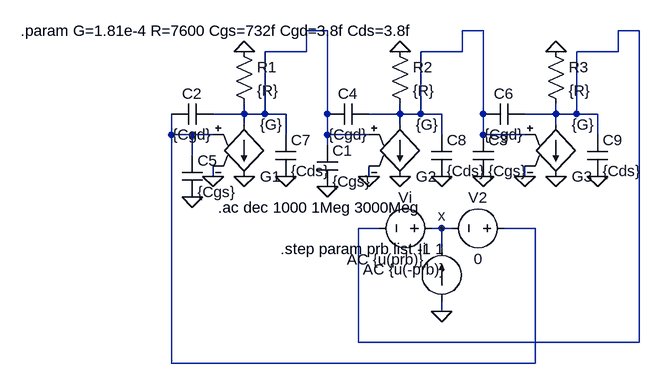
[diagram p0: schematic ringoscssm.asc]
ringoscssm.asc, the LTspice schematic file:
Version 4.1
SHEET 1 880 680
WIRE 256 16 224 16
WIRE 496 16 464 16
WIRE 736 16 704 16
WIRE 224 48 224 16
WIRE 224 48 160 48
WIRE 464 48 464 16
WIRE 464 48 400 48
WIRE 704 48 704 16
WIRE 704 48 640 48
WIRE 128 144 128 128
WIRE 128 144 80 144
WIRE 160 144 160 48
WIRE 160 144 128 144
WIRE 192 144 160 144
WIRE 256 144 256 16
WIRE 368 144 368 128
WIRE 368 144 320 144
WIRE 400 144 400 48
WIRE 400 144 368 144
WIRE 432 144 400 144
WIRE 496 144 496 16
WIRE 512 144 496 144
WIRE 608 144 608 128
WIRE 608 144 560 144
WIRE 640 144 640 48
WIRE 640 144 608 144
WIRE 672 144 640 144
WIRE 128 160 128 144
WIRE 368 160 368 144
WIRE 608 160 608 144
WIRE 16 176 16 144
WIRE 48 176 16 176
WIRE 80 176 48 176
WIRE 192 176 192 144
WIRE 256 176 256 144
WIRE 320 176 256 176
WIRE 432 176 432 144
WIRE 496 176 496 144
WIRE 560 176 496 176
WIRE 672 176 672 144
WIRE 256 192 256 176
WIRE 48 208 48 176
WIRE 80 240 80 224
WIRE 320 240 320 224
WIRE 560 240 560 224
WIRE 336 320 304 320
WIRE 432 320 416 320
WIRE 448 320 432 320
WIRE 576 320 528 320
WIRE 432 352 432 320
WIRE 432 448 432 432
WIRE 304 496 304 320
WIRE 736 496 736 16
WIRE 736 496 304 496
WIRE 16 528 16 176
WIRE 576 528 576 320
WIRE 576 528 16 528
FLAG 80 240 0
FLAG 128 240 0
FLAG 256 256 0
FLAG 368 48 0
FLAG 320 240 0
FLAG 368 240 0
FLAG 496 240 0
FLAG 608 48 0
FLAG 560 240 0
FLAG 608 240 0
FLAG 432 448 0
FLAG 432 320 x
FLAG 48 272 0
FLAG 192 240 0
FLAG 432 240 0
FLAG 672 240 0
FLAG 128 48 0
SYMBOL g2 128 256 M180
SYMATTR InstName G1
SYMATTR Value {G}
SYMBOL res 112 32 R0
SYMATTR InstName R1
SYMATTR Value {R}
SYMBOL cap 240 192 R0
SYMATTR InstName C1
SYMATTR Value {Cgs}
SYMBOL cap 80 128 R90
WINDOW 0 0 32 VBottom 2
WINDOW 3 32 32 VTop 2
SYMATTR InstName C2
SYMATTR Value {Cgd}
SYMBOL g2 368 256 M180
SYMATTR InstName G2
SYMATTR Value {G}
SYMBOL res 352 32 R0
SYMATTR InstName R2
SYMATTR Value {R}
SYMBOL cap 480 176 R0
SYMATTR InstName C3
SYMATTR Value {Cgs}
SYMBOL cap 320 128 R90
WINDOW 0 0 32 VBottom 2
WINDOW 3 32 32 VTop 2
SYMATTR InstName C4
SYMATTR Value {Cgd}
SYMBOL g2 608 256 M180
SYMATTR InstName G3
SYMATTR Value {G}
SYMBOL res 592 32 R0
SYMATTR InstName R3
SYMATTR Value {R}
SYMBOL cap 32 208 R0
SYMATTR InstName C5
SYMATTR Value {Cgs}
SYMBOL cap 560 128 R90
WINDOW 0 0 32 VBottom 2
WINDOW 3 32 32 VTop 2
SYMATTR InstName C6
SYMATTR Value {Cgd}
SYMBOL voltage 432 320 R90
WINDOW 0 -32 56 VBottom 2
WINDOW 3 32 56 VTop 2
WINDOW 123 48 56 VTop 2
WINDOW 39 0 0 Left 0
SYMATTR InstName Vi
SYMATTR Value ""
SYMATTR Value2 AC {u(-prb)}
SYMBOL voltage 544 320 R90
WINDOW 0 -32 56 VBottom 2
WINDOW 3 32 56 VTop 2
WINDOW 123 0 0 Left 0
WINDOW 39 0 0 Left 0
SYMATTR InstName V2
SYMATTR Value 0
SYMBOL current 432 432 R180
WINDOW 0 24 80 Left 2
WINDOW 3 24 0 Left 2
WINDOW 123 24 64 Left 2
WINDOW 39 0 0 Left 0
SYMATTR InstName Ii
SYMATTR Value ""
SYMATTR Value2 AC {u(prb)}
SYMBOL cap 176 176 R0
SYMATTR InstName C7
SYMATTR Value {Cds}
SYMBOL cap 416 176 R0
SYMATTR InstName C8
SYMATTR Value {Cds}
SYMBOL cap 656 176 R0
SYMATTR InstName C9
SYMATTR Value {Cds}
TEXT 88 288 Left 2 !.ac dec 1000 1Meg 3000Meg
TEXT 184 352 Left 2 !.step param prb list -1 1
TEXT -216 16 Left 2 !.param G=1.81e-4 R=7600 Cgs=732f Cgd=3.8f Cds=3.8f

The netlist it stands for:
* ringoscssm.asc
G1 N001 0 N004 0 {G}
R1 0 N001 {R}
C1 N001 0 {Cgs}
C2 N001 N004 {Cgd}
G2 N002 0 N001 0 {G}
R2 0 N002 {R}
C3 N002 0 {Cgs}
C4 N002 N001 {Cgd}
G3 N003 0 N002 0 {G}
R3 0 N003 {R}
C5 N004 0 {Cgs}
C6 N003 N002 {Cgd}
Vi x N003 AC {u(-prb)}
V2 N004 x 0
Ii 0 x AC {u(prb)}
C7 N001 0 {Cds}
C8 N002 0 {Cds}
C9 N003 0 {Cds}
.ac dec 1000 1Meg 3000Meg
.step param prb list -1 1
.param G=1.81e-4 R=7600 Cgs=732f Cgd=3.8f Cds=3.8f
.backanno
.end